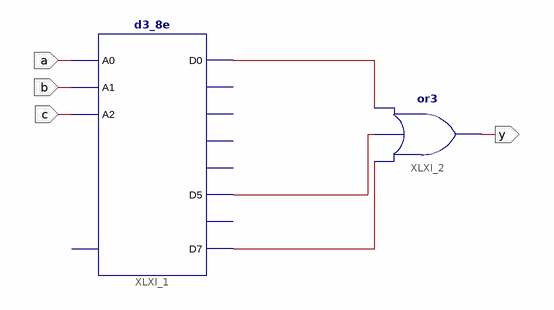
[diagram p0: schematic sheet 1]
// Xilinx ISE schematic uloha3.sch (spartan3) as structural Verilog: 2 symbols, 4 ports
module uloha3 (
  input  a,
  input  b,
  input  c,
  output y
);

  wire XLXN_5, XLXN_6, XLXN_7;

  d3_8e XLXI_1 (.A0(a), .A1(b), .A2(c), .D0(XLXN_5), .D5(XLXN_6), .D7(XLXN_7));  // open: E, D1, D2, D3, D4, D6
  or XLXI_2 (y, XLXN_7, XLXN_6, XLXN_5);
endmodule
